# Altium schematic sheet LED.SchDoc: LED
size 420 x 297 mm; SheetNumber: 10; SheetTotal: 11
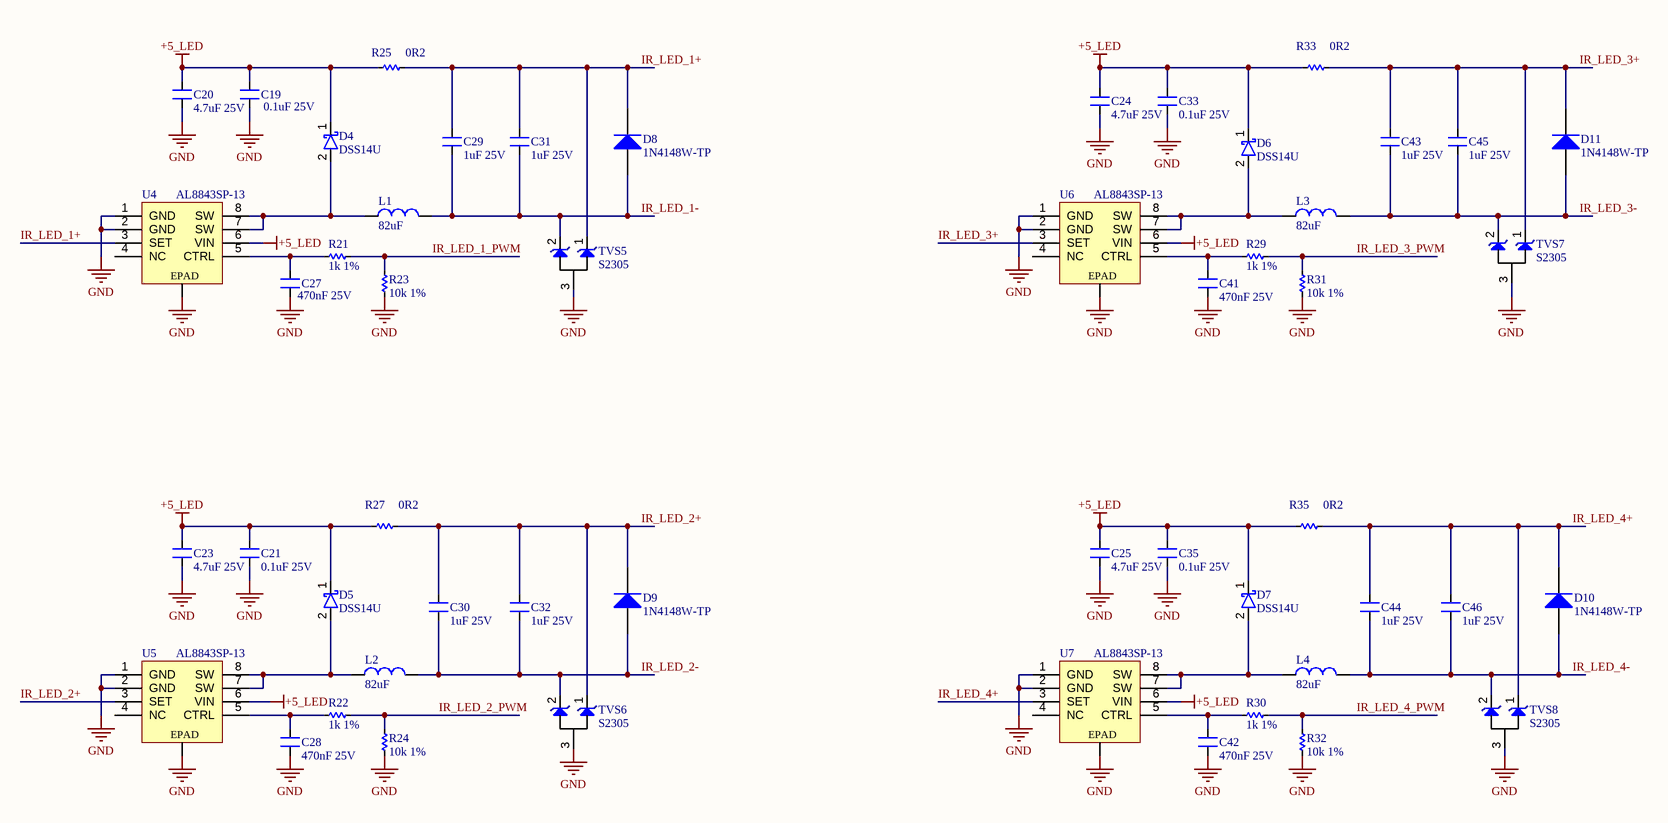
[diagram p0: LED.SchDoc]

## Parts
C19  0.1uF 25V  [CN-SMD-0603]
C20  4.7uF 25V  [CN-SMD-0603]
C21  0.1uF 25V  [CN-SMD-0603]
C23  4.7uF 25V  [CN-SMD-0603]
C24  4.7uF 25V  [CN-SMD-0603]
C25  4.7uF 25V  [CN-SMD-0603]
C27  470nF 25V  [CN-SMD-0603]
C28  470nF 25V  [CN-SMD-0603]
C29  1uF 25V  [CN-SMD-0603]
C30  1uF 25V  [CN-SMD-0603]
C31  1uF 25V  [CN-SMD-0603]
C32  1uF 25V  [CN-SMD-0603]
C33  0.1uF 25V  [CN-SMD-0603]
C35  0.1uF 25V  [CN-SMD-0603]
C41  470nF 25V  [CN-SMD-0603]
C42  470nF 25V  [CN-SMD-0603]
C43  1uF 25V  [CN-SMD-0603]
C44  1uF 25V  [CN-SMD-0603]
C45  1uF 25V  [CN-SMD-0603]
C46  1uF 25V  [CN-SMD-0603]
D4  DSS14U  [sod-123]
D5  DSS14U  [sod-123]
D6  DSS14U  [sod-123]
D7  DSS14U  [sod-123]
D8  1N4148W-TP  [SOD-123]
D9  1N4148W-TP  [SOD-123]
D10  1N4148W-TP  [SOD-123]
D11  1N4148W-TP  [SOD-123]
L1  82uF  [L-SMD-M-4.8x4.8x2.8mm]
L2  82uF  [L-SMD-M-4.8x4.8x2.8mm]
L3  82uF  [L-SMD-M-4.8x4.8x2.8mm]
L4  82uF  [L-SMD-M-4.8x4.8x2.8mm]
R21  1k 1%  [RES-SMD-0603]
R22  1k 1%  [RES-SMD-0603]
R23  10k 1%  [RES-SMD-0603]
R24  10k 1%  [RES-SMD-0603]
R25  0R2  [RES-SMD-1206]
R27  0R2  [RES-SMD-1206]
R29  1k 1%  [RES-SMD-0603]
R30  1k 1%  [RES-SMD-0603]
R31  10k 1%  [RES-SMD-0603]
R32  10k 1%  [RES-SMD-0603]
R33  0R2  [RES-SMD-1206]
R35  0R2  [RES-SMD-1206]
TVS5  S2305  [sot23-12_3]
TVS6  S2305  [sot23-12_3]
TVS7  S2305  [sot23-12_3]
TVS8  S2305  [sot23-12_3]
U4  AL8843SP-13  [SO8_EPAD]
U5  AL8843SP-13  [SO8_EPAD]
U6  AL8843SP-13  [SO8_EPAD]
U7  AL8843SP-13  [SO8_EPAD]

## Nets
+5_LED: C19.2 C20.2 C21.2 C23.2 C24.2 C25.2 C33.2 C35.2 D4.1 D5.1 D6.1 D7.1 R25.2 R27.2 R33.2 R35.2 U4.6(VIN) U5.6(VIN) U6.6(VIN) U7.6(VIN)
GND: C19.1 C20.1 C21.1 C23.1 C24.1 C25.1 C27.1 C28.1 C33.1 C35.1 C41.1 C42.1 R23.1 R24.1 R31.1 R32.1 TVS5.3 TVS6.3 TVS7.3 TVS8.3 U4.1(GND) U4.2(GND) U4.EPAD U5.1(GND) U5.2(GND) U5.EPAD U6.1(GND) U6.2(GND) U6.EPAD U7.1(GND) U7.2(GND) U7.EPAD
IR_LED_1+: C29.2 C31.2 D8.2(K) R25.1 TVS5.1 U4.3(SET)
IR_LED_1-: C29.1 C31.1 D8.1(A) L1.2 TVS5.2
IR_LED_1_PWM: R21.2 R23.2
IR_LED_2+: C30.2 C32.2 D9.2(K) R27.1 TVS6.1 U5.3(SET)
IR_LED_2-: C30.1 C32.1 D9.1(A) L2.2 TVS6.2
IR_LED_2_PWM: R22.2 R24.2
IR_LED_3+: C43.2 C45.2 D11.2(K) R33.1 TVS7.1 U6.3(SET)
IR_LED_3-: C43.1 C45.1 D11.1(A) L3.2 TVS7.2
IR_LED_3_PWM: R29.2 R31.2
IR_LED_4+: C44.2 C46.2 D10.2(K) R35.1 TVS8.1 U7.3(SET)
IR_LED_4-: C44.1 C46.1 D10.1(A) L4.2 TVS8.2
IR_LED_4_PWM: R30.2 R32.2
NetC27_2: C27.2 R21.1 U4.5(CTRL)
NetC28_2: C28.2 R22.1 U5.5(CTRL)
NetC41_2: C41.2 R29.1 U6.5(CTRL)
NetC42_2: C42.2 R30.1 U7.5(CTRL)
NetD4_2: D4.2 L1.1 U4.7(SW) U4.8(SW)
NetD5_2: D5.2 L2.1 U5.7(SW) U5.8(SW)
NetD6_2: D6.2 L3.1 U6.7(SW) U6.8(SW)
NetD7_2: D7.2 L4.1 U7.7(SW) U7.8(SW)

Not connected (* = marked no-connect by the designer): U4 4(NC); U5 4(NC); U6 4(NC); U7 4(NC)

## Notes on the sheet
- Project:
- BEE-PC1
- Sub-system:
- NANORACK_EXP_CONTROLLER
- Design by:
- SANG HUYNH
- BAO BUI Q.
- Sheet title:
- Sheet
- A3
- of
- Checked by:
- Approved by:
- VU PHAM
- Revision:
- Document No:
- V1.0.0
- Size:
- Date:
- 01/10/2024

## Library data of the parts
C19-C21 C23-C25 C27-C33 C35 C41-C46 = Capacitors: Value: 33pF
D8-D11 = 1N4148-W-7: DIODE GEN PURP 100V 300MA SOD123; MPN: 1N4148W-7-F; MFR: Diodes Incorporated; Solder: SMT; Value: 100V/300MA
L1-L4 = L-SMD-1: FIXED IND 82UH 2.25A 160MOHM SMD / PN: 744770182; partNo: 78477010; Manufacturer: Wurth Elektronik; Inductance: 1.0 μH; ComponentLink1Description: Manufacturer; ComponentLink1URL: http://www.we-online.de; Created by: Baojun Chen; Created Date: Nov.2015; ComponentLink2Description: Datasheet; ComponentLink2URL: http://katalog.we-online.de/pbs/datasheet/78477010.pdf
R21-R24 R29-R32 = Res SMD: SMD; Manufacturer: Generic Components; Class: Passive; Published: 08/06/2000; Publisher: Altium Hobart Technology Centre
R25 R27 R33 R35 = Res-SMD: RES 0.1 OHM 1% 1W 1206 / PN: PE1206FRF470R1L; Manufacturer: Generic Components; Class: Passive; Published: 08/06/2000; Publisher: Altium Hobart Technology Centre
TVS5-TVS8 = S2305: TVS DIODE 5VWM 10.8VC SOT23
U4-U7 = AL8843SP-13: IC LED DRIVER RGLTR PWM 3A 8SO